# Altium schematic sheet Power_Supply.SchDoc
size A4
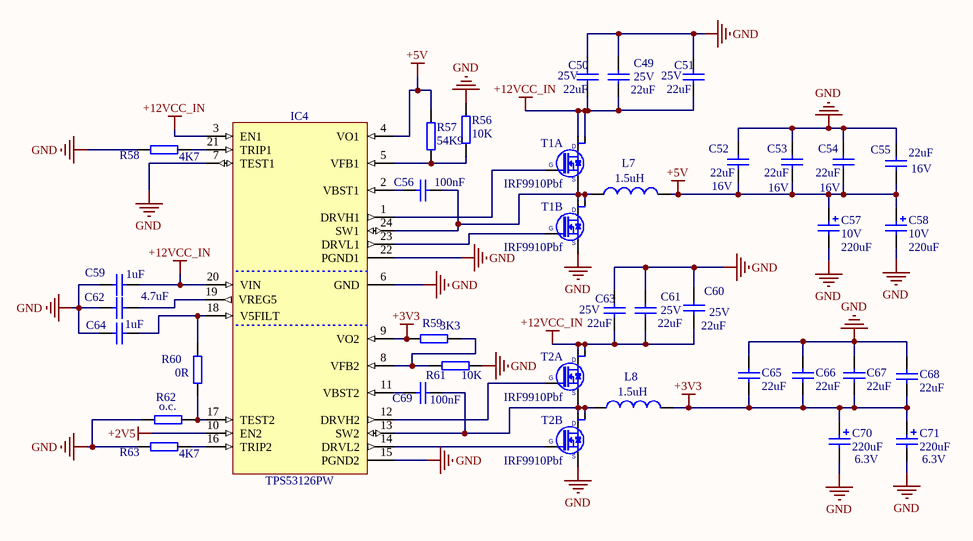
[diagram p0: Power_Supply.SchDoc]

## Parts
C49  value 22uF  Voltage: 25V  [CC3216-1206]  (hidden comment: 22uF 25V)
C50  value 22uF  Voltage: 25V  [CC3216-1206]  (hidden comment: 22uF 25V)
C51  value 22uF  Voltage: 25V  [CC3216-1206]  (hidden comment: 22uF 25V)
C52  value 22uF  Voltage: 16V  [CC2012-0805]  (hidden comment: 22uF 16V)
C53  value 22uF  Voltage: 16V  [CC2012-0805]  (hidden comment: 22uF 16V)
C54  value 22uF  Voltage: 16V  [CC2012-0805]  (hidden comment: 22uF 16V)
C55  value 22uF  Voltage: 16V  [CC2012-0805]  (hidden comment: 22uF 16V)
C56  100nF  [CC1005-0402]
C57  value 220uF  Voltage: 10V  [D]  (hidden comment: 220uF 10V)
C58  value 220uF  Voltage: 10V  [D]  (hidden comment: 220uF 10V)
C59  1uF  [CC1608-0603]
C60  value 22uF  Voltage: 25V  [CC3216-1206]  (hidden comment: 22uF 25V)
C61  value 22uF  Voltage: 25V  [CC3216-1206]  (hidden comment: 22uF 25V)
C62  4.7uF  [CC1608-0603]
C63  value 22uF  Voltage: 25V  [CC3216-1206]  (hidden comment: 22uF 25V)
C64  1uF  [CC1005-0402]
C65  22uF  [CC2012-0805]
C66  22uF  [CC2012-0805]
C67  22uF  [CC2012-0805]
C68  22uF  [CC2012-0805]
C69  100nF  [CC1005-0402]
C70  Voltage: 6.3V  [D]  (hidden comment: 220uF)
C71  Voltage: 6.3V  [D]  (hidden comment: 220uF)
IC4  TPS53126PW  [SOP65P640X120-24N]
L7  value 1.5uH  [IHLP2525]  (hidden comment: IHLP2525CZER1R5M01)
L8  value 1.5uH  [IHLP2525]  (hidden comment: IHLP2525CZER1R5M01)
R56  10K  [0402]
R57  54K9  [0603]
R58  4K7  [0402]
R59  3K3  [0603]
R60  value 0R  [0402]  (hidden comment: Jumper)
R61  10K  [0402]
R62  o.c.  [0402]
R63  4K7  [0402]
T1  IRF9910Pbf  [SOIC127P600X175-8N]  (parts A,B of 2)
T2  IRF9910Pbf  [SOIC127P600X175-8N]  (parts A,B of 2)

## Nets
+2V5: IC4.10(EN2)
+3V3: C65.2 C66.1 C67.1 C68.1 C70.1 C71.1 IC4.9(VO2) L8.2 R59.1
+5V: C52.1 C53.1 C54.1 C55.1 C57.1 C58.1 IC4.4(VO1) L7.2 R57.2
+12VCC_IN: C49.1 C50.1 C51.1 C59.2 C60.1 C61.1 C63.1 IC4.3(EN1) IC4.20(VIN) T1.5(D) T1.6(D) T2.5(D) T2.6(D)
GND: C49.2 C50.2 C51.2 C52.2 C53.2 C54.2 C55.2 C57.2 C58.2 C59.1 C60.2 C61.2 C62.2 C63.2 C64.1 C65.1 C66.2 C67.2 C68.2 C70.2 C71.2 IC4.6(GND) IC4.7(TEST1) IC4.15(PGND2) IC4.22(PGND1) R56.2 R58.2 R61.2 R62.1 R63.2 T1.1(S) T2.1(S)
NetC56_1: C56.1 IC4.2(VBST1)
NetC56_2: C56.2 IC4.24(SW1) L7.1 T1.3(S) T1.7(D) T1.8(D)
NetC62_1: C62.1 IC4.19(VREG5)
NetC64_2: C64.2 IC4.18(V5FILT) R60.1
NetC69_1: C69.1 IC4.11(VBST2)
NetC69_2: C69.2 IC4.13(SW2) L8.1 T2.3(S) T2.7(D) T2.8(D)
NetIC4_1: IC4.1(DRVH1) T1.4(G)
NetIC4_5: IC4.5(VFB1) R56.1 R57.1
NetIC4_8: IC4.8(VFB2) R59.2 R61.1
NetIC4_12: IC4.12(DRVH2) T2.4(G)
NetIC4_14: IC4.14(DRVL2) T2.2(G)
NetIC4_16: IC4.16(TRIP2) R63.1
NetIC4_17: IC4.17(TEST2) R60.2 R62.2
NetIC4_21: IC4.21(TRIP1) R58.1
NetIC4_23: IC4.23(DRVL1) T1.2(G)

## Library data of the parts
C49-C51 C60 C61 C63 = CC1206_22UF_25V_10%_X5R: Capacitor; Manufacturer1: Murata; Manufacturer1 PN: GRM31CR61E226KE15L; TC: X5R; Tolerance: ±10%; Published: 8-Jun-2000; LatestRevisionDate: 17-Jul-2002; LatestRevisionNote: Re-released for DXP Platform.; PackageReference: RAD-0.3; Publisher: Altium Limited; Distributor1: Digikey; Distributor1 PN: 490-5527-1-ND; Case: 1206
C52-C55 = CC0805_22UF_16V_10%_X5R: Capacitor; Manufacturer1: Phycomp; Manufacturer1 PN: C2012X5R1C226K; TC: X7R; Tolerance: ±10%; Published: 8-Jun-2000; LatestRevisionDate: 17-Jul-2002; LatestRevisionNote: Re-released for DXP Platform.; PackageReference: RAD-0.3; Publisher: Altium Limited; Distributor1: Digikey; Distributor1 PN: 445-6797-1-ND; Case: 0805
C56 C69 = CC0402_100NF_16V_10%_X7R: Capacitor; Manufacturer1: TDK; Manufacturer1 PN: C1005X7R1C104K; TC: X7R; Tolerance: ±10%; Voltage: 16V; Published: 8-Jun-2000; LatestRevisionDate: 17-Jul-2002; LatestRevisionNote: Re-released for DXP Platform.; PackageReference: RAD-0.3; Publisher: Altium Limited; Distributor1: Digikey; Distributor1 PN: 445-4952-1-ND; Case: 0402; Value: 100nF
C57 C58 = CP2917_220UF_10V_20%_TANT: Polarized Capacitor Tantalum; Manufacturer1: Kemet; Manufacturer1 PN: T520D227M010ATE018; Tolerance: ±20%; ESR: 18mOhm; Published: 8-Jun-2000; LatestRevisionDate: 17-Jul-2002; LatestRevisionNote: Re-released for DXP Platform.; PackageReference: RB7.6-15; Publisher: Altium Limited; Case: 2917; Distributor1: Digikey; Distributor1 PN: 399-4045-1-ND; TC: Tantalum
C59 = CC0603_1UF_25V_10%_X5R: Capacitor; Manufacturer1: Phycomp; Manufacturer1 PN: GRM188R61E105KA12D; TC: X5R; Tolerance: ±10%; Voltage: 25V; Published: 8-Jun-2000; LatestRevisionDate: 17-Jul-2002; LatestRevisionNote: Re-released for DXP Platform.; Publisher: Altium Limited; Distributor1: Digikey; Distributor1 PN: 490-3897-1-ND; Case: 0603; Value: 1uF
C62 = CC0603_4.7UF_10V_10%_X5R: Capacitor; Manufacturer1: TDK; Manufacturer1 PN: C1608X5R1A475K; TC: X5R; Tolerance: ±10%; Voltage: 10V; Published: 8-Jun-2000; LatestRevisionDate: 17-Jul-2002; LatestRevisionNote: Re-released for DXP Platform.; PackageReference: RAD-0.3; Publisher: Altium Limited; Distributor1: Digikey; Distributor1 PN: 445-5170-1-ND; Case: 0603; Value: 4.7uF
C64 = CC0402_1UF_16V_10%_X5R: Capacitor; Manufacturer1: TDK; Manufacturer1 PN: C1005X5R1C105K; TC: X5R; Tolerance: ±10%; Voltage: 16V; Published: 8-Jun-2000; LatestRevisionDate: 17-Jul-2002; LatestRevisionNote: Re-released for DXP Platform.; PackageReference: RAD-0.3; Publisher: Altium Limited; Distributor1: Digikey; Distributor1 PN: 445-4978-1-ND; Case: 0402; Value: 1uF
C65-C68 = CC0805_22UF_6.3V_20%_X5R: Capacitor; Manufacturer1: TDK; Manufacturer1 PN: C2012X5R0J226M; TC: X5R; Tolerance: ±20%; Voltage: 6.3V; Published: 8-Jun-2000; LatestRevisionDate: 17-Jul-2002; LatestRevisionNote: Re-released for DXP Platform.; PackageReference: RAD-0.3; Publisher: Altium Limited; Distributor1: Digikey; Distributor1 PN: 445-1422-1-ND; Case: 0805; Value: 22uF
C70 C71 = CP2917_220UF_6.3V_20%_TANT: Polarized Capacitor Tantalum; Manufacturer1: Kemet; Manufacturer1 PN: T520D227M006ATE009; Tolerance: ±20%; ESR: 9mOhm; Published: 8-Jun-2000; LatestRevisionDate: 17-Jul-2002; LatestRevisionNote: Re-released for DXP Platform.; PackageReference: RB7.6-15; Publisher: Altium Limited; Case: 2917; Distributor1: Digikey; Distributor1 PN: T520D227M006ATE009; TC: Tantalum; Value: 220uF
IC4 = TPS53126PW: Dual Synchronous Step-Down Controller For Low Voltage Power Rails; Manufacturer: TEXAS INSTRUMENTS; Table: Analog & Interface; Part Number: TPS53126PW; Component Kind: Standard; Component Type: Standard; Device: TPS53126PW; PackageDescription: SOP, 0.65mm Pitch; 24 Pin, 4.40mm W X 7.80mm L X 1.20mm H Body, IPC Medium Density; Part Description: Dual Synchronous Step-Down Controller For Low Voltage Power Rails; Manufacturer Part Number: TPS53126PW; Pin Count: 24; Case: QFN24; Mounted: Yes; Socket: No; SMD: Yes; ComponentHeight: 1.0mm; Author: CERN DEM JLC; HelpURL: \\cern.ch\dfs\Applications\Altium\Datasheets\TPS53126RGET.pdf; CreateDate: 2010-08-26; LatestRevisionDate: 2010-08-26; Distributor1: Digikey; Distributor1 PN: 296-24555-1-ND
L7 L8 = Inductor: Low Profile, High Current Inductor; Manufacturer: Vishay/Dale; Published: 8-Jun-2000; Revision: July-2002: Re-released for DXP Platform.; Publisher: Altium Limited; Manufacturer PN: IHLP2525CZER1R5M01; Distributor1 PN: 541-1007-1-ND; Distributor1: Digikey
R56 R61 = R0402_10K_±1%_0.1W_100PPM: SMD Resistor; Manufacturer1: Panasonic; Manufacturer1 PN: ERJ-2RKF1002X; TCR: 100ppm; Power Rating: 0.1W; Tolerance: ±1%; Case: 0402; Distributor1: DigiKey; Distributor1 PN: P10.0KLCT-ND; Value: 10K
R57 = R0603_54K9_±1%_0.1W_100PPM: SMD Resistor; Manufacturer1: Panasonic; Manufacturer1 PN: ERJ-3EKF5492V; TCR: 100ppm; Power Rating: 0.1W; Tolerance: ±1%; Case: 0603; Distributor1: DigiKey; Distributor1 PN: P54.9KHCT-ND; Value: 54K9
R58 R63 = R0402_4.7K_±1%_0.1W_100PPM: SMD Resistor; Manufacturer1: Panasonic; Manufacturer1 PN: ERJ-2RKF4701X; TCR: 100ppm; Power Rating: 0.1W; Tolerance: ±1%; Case: 0402; Distributor1: DigiKey; Distributor1 PN: ERJ-2RKF4701X; Value: 4K7
R59 = R0603_3K3_±1%_0.1W_100PPM: SMD Resistor; Manufacturer1: Yageo; Manufacturer1 PN: RC0603FR-073K3L; TCR: 100ppm; Power Rating: 0.1W; Tolerance: ±1%; Case: 0603; Distributor1: DigiKey; Distributor1 PN: 311-3.30KHRCT-ND; Value: 3K3
R60 = R0402_0R_0.1W_JUMPER: SMD Resistor; Manufacturer1: Panasonic; Manufacturer1 PN: ERJ-2GE0R00X; TCR: 100ppm; Power Rating: 0.1W; Case: 0402; Distributor1: DigiKey; Distributor1 PN: P0.0JCT-ND; Tolerance: Jumper
R62 = R0402_O.C.: SMD Resistor; Case: 0402; Manufacturer1: N/A; Manufacturer1 PN: N/A; Distributor1: N/A; Distributor1 PN: N/A; TCR: N/A; Power Rating: N/A; Tolerance: N/A; Value: o.c.
T1 T2 = IRF9910Pbf: Dual SO-8 MOSFET For POL Cconverter; Part Description: 20V 10A(Q1) 20V 12A (Q2) Dual SO-8 MOSFET For POL Cconverter; Manufacturer: INTERNATIONAL RECTIFIER; Table: Transistors; Part Number: IRF9910Pbf; Component Kind: Standard; Component Type: Standard; Device: IRF9910Pbf; PackageDescription: SOIC 8, Pitch 1.27mm - Body 4x5mm, IPC Medium Density; Manufacturer Part Number: IRF9910Pbf; Pin Count: 8; Case: DO8; Mounted: Yes; Socket: No; SMD: Yes; ComponentHeight: 1.75mm; HelpURL: \\cern.ch\dfs\Applications\Altium\Datasheets\IRF9910Pbf.pdf; Author: CERN DEM JLC; CreateDate: 30/08/2010; LatestRevisionDate: 30/08/2010